# Altium project STM32MEGA.PrjPcb
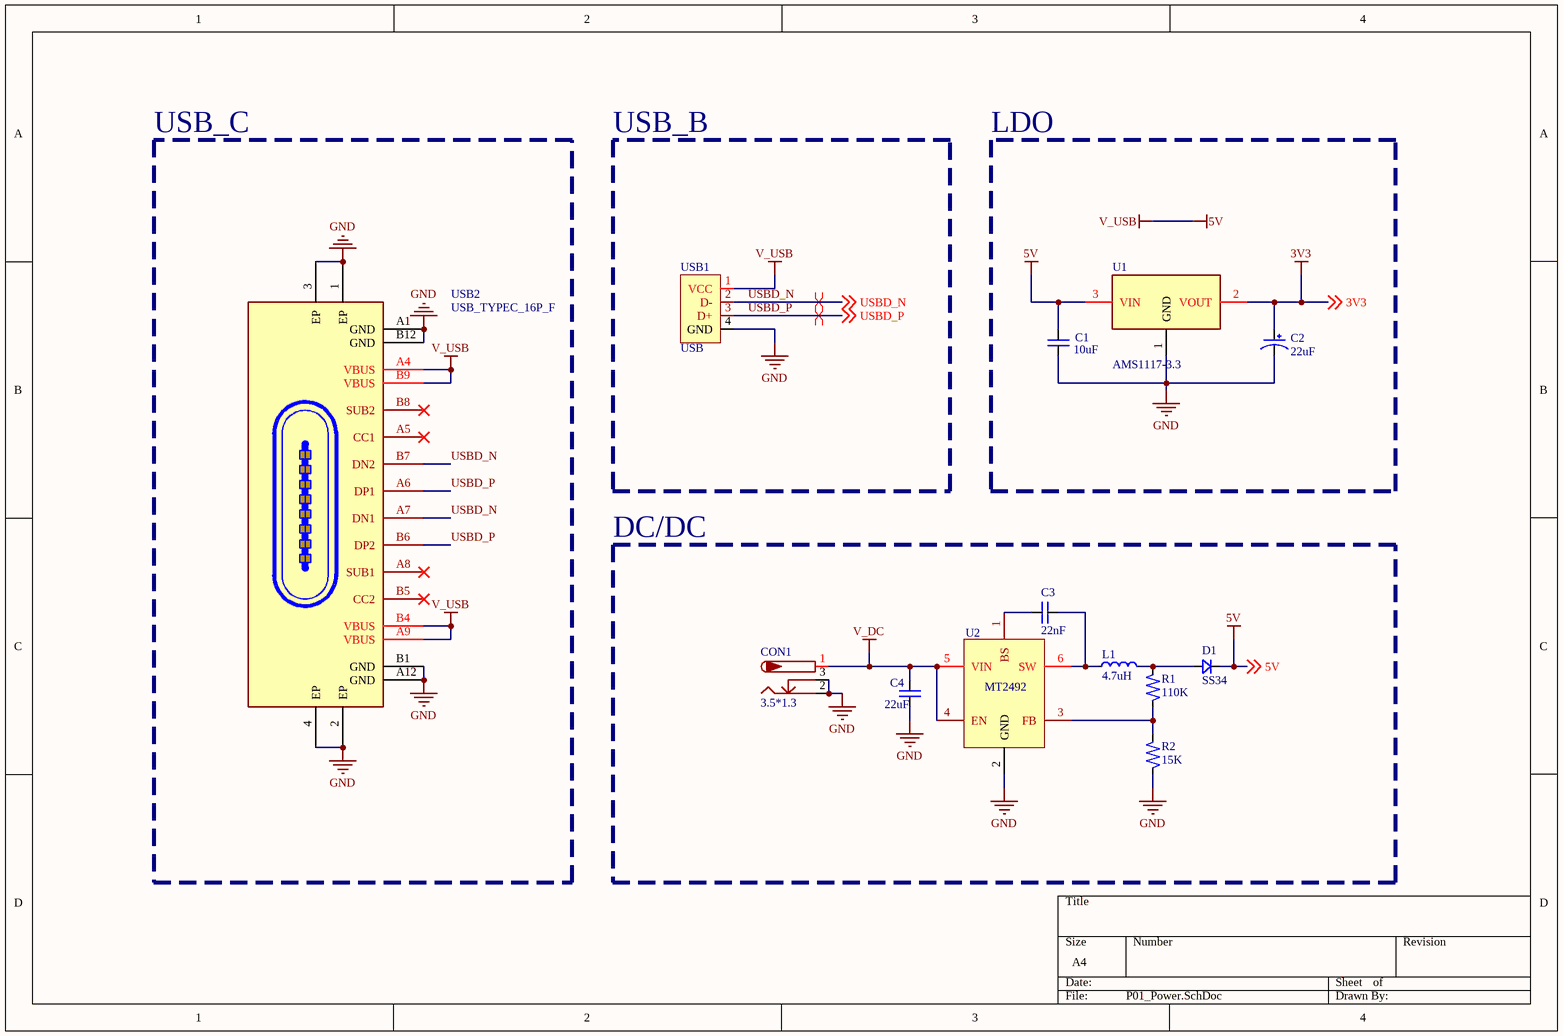
[diagram p0: P01_Power.SchDoc]
3 sheets, 53 parts. Net scope: global (net labels, ports and power ports of the same name join across sheets).
Board file: PCB.PcbDoc
Sheets:
  P01_Power.SchDoc
  P02_MCU.SchDoc
  P03_Connectors.SchDoc

## Sheet P01_Power.SchDoc
size A4; SheetNumber: 1; SheetTotal: 3

### Parts
C1  10uF  [C_0805]
C2  22uF  [CASE-A-3216]
C3  22nF  [C_0603]
C4  22uF  [C_0603]
CON1  3.5*1.3  [DC_Input]
D1  SS34  [SMA]
L1  4.7uH  [L_SMD0420]
R1  110K  [R_0603]
R2  15K  [R_0603]
U1  AMS1117-3.3  [SOT-223]
U2  MT2492  [SOT23-6]
USB1  USB  [USB_TYPEB_4P]
USB2  USB_TYPEC_16P_F  [USB_TYPEC_16P]

### Blocks framed on the sheet
USB_C: USB2
USB_B: USB1
LDO: C1 C2 U1
DC/DC: C3 C4 CON1 D1 L1 R1 R2 U2

### Nets
3V3: C2.1 U1.2(VOUT) ; off-sheet 3V3
5V: C1.1 D1.1 U1.3(VIN) USB1.1(VCC) USB2.A4(VBUS) USB2.A9(VBUS) USB2.B4(VBUS) USB2.B9(VBUS) ; off-sheet 5V  [also labelled V_USB]
GND: C1.2 C2.2 C4.2 CON1.2 CON1.3 R2.1 U1.1(GND) U2.2(GND) USB1.4(GND) USB2.1(EP) USB2.2(EP) USB2.3(EP) USB2.4(EP) USB2.A1(GND) USB2.A12(GND) USB2.B1(GND) USB2.B12(GND)
V_DC: C4.1 CON1.1 U2.4(EN) U2.5(VIN)
USBD_N: USB1.2(D-) USB2.A7(DN1) USB2.B7(DN2) ; off-sheet USBD_N
USBD_P: USB1.3(D+) USB2.A6(DP1) USB2.B6(DP2) ; off-sheet USBD_P
NetC3_1: C3.1 U2.1(BS)
NetC3_2: C3.2 L1.2 U2.6(SW)
NetD1_2: D1.2 L1.1 R1.2
NetR1_1: R1.1 R2.2 U2.3(FB)

Not connected (* = marked no-connect by the designer): USB2 A5(CC1)* A8(SUB1)* B5(CC2)* B8(SUB2)*

### Layout directives
differential pair: USBD_N, USBD_P

### Library data of the parts
C1 C3 C4 = C: 无极性电容
C2 = C_Tan: Tantalum Capacitor / 钽电容
CON1 = DC_Input: 低压电源接口
D1 = D: Diode
L1 = L: Inductor
R1 R2 = R: Resistor
U1 = AMS1117-3.3: LDO to 3V3
U2 = MT2492: BUCK / https://atta.szlcsc.com/upload/public/pdf/source/20221209/5C81DA9662873D3A116170FFBF63E49D.pdf
USB1 = USB_4Pin
USB2 = USB_TYPEC_16P_F: USB母座，TYPEC，16pin

## Sheet P02_MCU.SchDoc
size A4; SheetNumber: 2; SheetTotal: 3
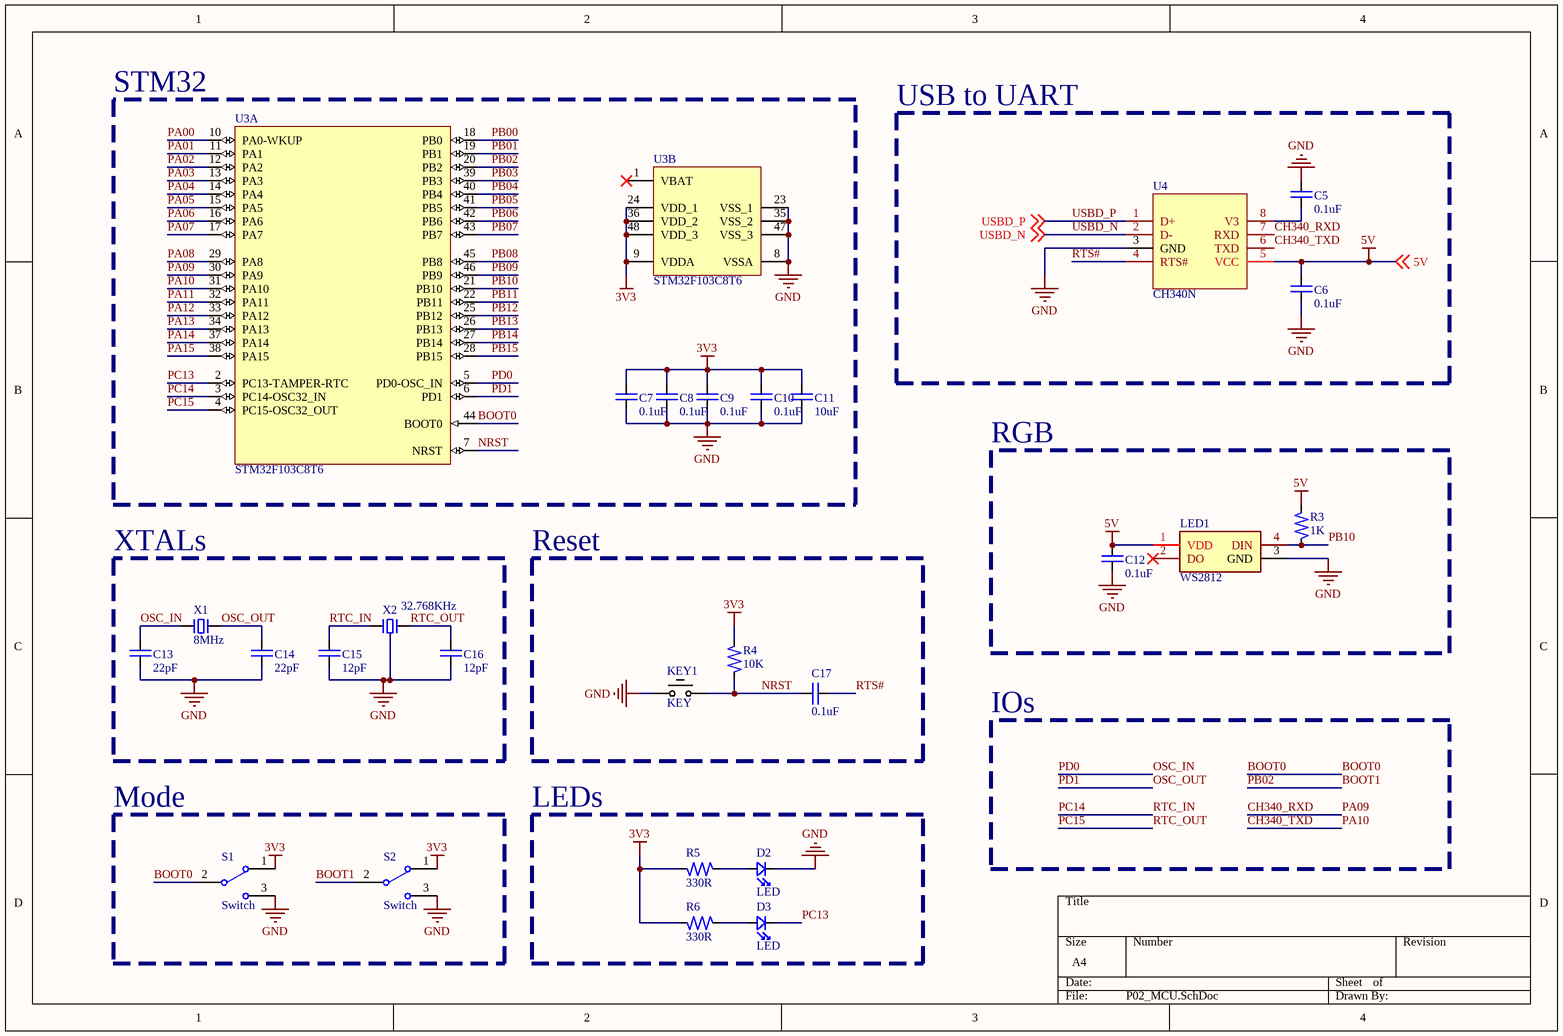
[diagram p1: P02_MCU.SchDoc]

### Parts
C5  0.1uF  [C_0603]
C6  0.1uF  [C_0603]
C7  0.1uF  [C_0603]
C8  0.1uF  [C_0603]
C9  0.1uF  [C_0603]
C10  0.1uF  [C_0603]
C11  10uF  [C_0603]
C12  0.1uF  [C_0603]
C13  22pF  [C_0603]
C14  22pF  [C_0603]
C15  12pF  [C_0603]
C16  12pF  [C_0603]
C17  0.1uF  [C_0603]
D2  LED  [LED_0603]
D3  LED  [LED_0603]
KEY1  KEY  [KEY]
LED1  WS2812  [SMD5050]
R3  1K  [R_0603]
R4  10K  [R_0603]
R5  330R  [R_0603]
R6  330R  [R_0603]
S1  Switch  [Sliding Switch_3P]
S2  Switch  [Sliding Switch_3P]
U3  STM32F103C8T6  [QFP-48]  (parts A,B of 2)
U4  CH340N  [SOP-8]
X1  8MHz  [XTAL_HC49S]
X2  32.768KHz  [XTAL_DT26]

### Blocks framed on the sheet
STM32: C7-C11 U3
USB to UART: C5 C6 U4
RGB: C12 LED1 R3
XTALs: C13-C16 X1 X2
Reset: C17 KEY1 R4
Mode: S1 S2
LEDs: D2 D3 R5 R6

### Nets
3V3: C7.1 C8.2 C9.2 C10.2 C11.2 R4.1 R5.1 R6.1 S1.1 S2.1 U3.9(VDDA) U3.24(VDD_1) U3.36(VDD_2) U3.48(VDD_3)
5V: C6.1 C12.1 LED1.1(VDD) R3.2 U4.5(VCC) ; off-sheet 5V
GND: C5.1 C6.2 C7.2 C8.1 C9.1 C10.1 C11.1 C12.2 C13.2 C14.2 C15.2 C16.2 D2.1 KEY1.2 LED1.3(GND) S1.3 S2.3 U3.8(VSSA) U3.23(VSS_1) U3.35(VSS_2) U3.47(VSS_3) U4.3(GND) X2.0
BOOT0: S1.2 U3.44(BOOT0)
BOOT1: S2.2 U3.20(PB2)  [also labelled PB02]
CH340_RXD: U3.30(PA9) U4.7(RXD)  [also labelled PA09]
CH340_TXD: U3.31(PA10) U4.6(TXD)  [also labelled PA10]
NRST: C17.1 KEY1.1 R4.2 U3.7(NRST)
OSC_IN: C13.1 U3.5(PD0-OSC_IN) X1.1  [also labelled PD0]
OSC_OUT: C14.1 U3.6(PD1) X1.2  [also labelled PD1]
PA00: U3.10(PA0-WKUP)
PA01: U3.11(PA1)
PA02: U3.12(PA2)
PA03: U3.13(PA3)
PA04: U3.14(PA4)
PA05: U3.15(PA5)
PA06: U3.16(PA6)
PA07: U3.17(PA7)
PA08: U3.29(PA8)
PA11: U3.32(PA11)
PA12: U3.33(PA12)
PA13: U3.34(PA13)  [project net JTMS_SWDIO]
PA14: U3.37(PA14)  [project net JTCK_SWCLK]
PA15: U3.38(PA15)  [project net JTDI]
PB00: U3.18(PB0)
PB01: U3.19(PB1)
PB03: U3.39(PB3)  [project net JTDO]
PB04: U3.40(PB4)  [project net NJTRST]
PB05: U3.41(PB5)
PB06: U3.42(PB6)
PB07: U3.43(PB7)
PB08: U3.45(PB8)
PB09: U3.46(PB9)
PB10: LED1.4(DIN) R3.1 U3.21(PB10)
PB11: U3.22(PB11)
PB12: U3.25(PB12)
PB13: U3.26(PB13)
PB14: U3.27(PB14)
PB15: U3.28(PB15)
PC13: D3.1 U3.2(PC13-TAMPER-RTC)
PC14: C15.1 U3.3(PC14-OSC32_IN) X2.1  [also labelled RTC_IN]
PC15: C16.1 U3.4(PC15-OSC32_OUT) X2.2  [also labelled RTC_OUT]
RTS#: C17.2 U4.4(RTS#)
USBD_N: U4.2(D-) ; off-sheet USBD_N
USBD_P: U4.1(D+) ; off-sheet USBD_P
NetC5_2: C5.2 U4.8(V3)
NetD2_2: D2.2 R5.2
NetD3_2: D3.2 R6.2

Not connected (* = marked no-connect by the designer): LED1 2(DO)*; U3 1(VBAT)*

### Notes on the sheet
- IOs

### Library data of the parts
C5-C17 = C: 无极性电容
D2 D3 = LED: Diode
KEY1 = KEY: 通用2脚按键
R3-R6 = R: Resistor
U3 = STM32F103C8T6: STM32 ARM-based 32-bit MCU Performance Line with 64 kB Flash, 20 kB Internal RAM, -40 to +85 Temperature, 48-Pin LQFP, Tray; ComponentLink1Description: Manufacturer URL; ComponentLink1URL: http://www.st.com/; ComponentLink2Description: STM32F103 Datasheet; ComponentLink2URL: http://www.st.com/internet/com/TECHNICAL_RESOURCES/TECHNICAL_LITERATURE/DATASHEET/CD00161566.pdf; ComponentLink3Description: STM32 Family Web Page; ComponentLink3URL: www.st.com/stm32; PackageReference: LQFP48; PackageDescription: 48-Pin Low-Profile Quad Flat Pack, 7 x 7 mm Body, 0.5 mm Pitch (LQFP48)
U4 = CH340N: USB转UART
X1 = XTAL: 晶振
X2 = XTAL_RTC: 晶振

## Sheet P03_Connectors.SchDoc
size A4; SheetNumber: 3; SheetTotal: 3
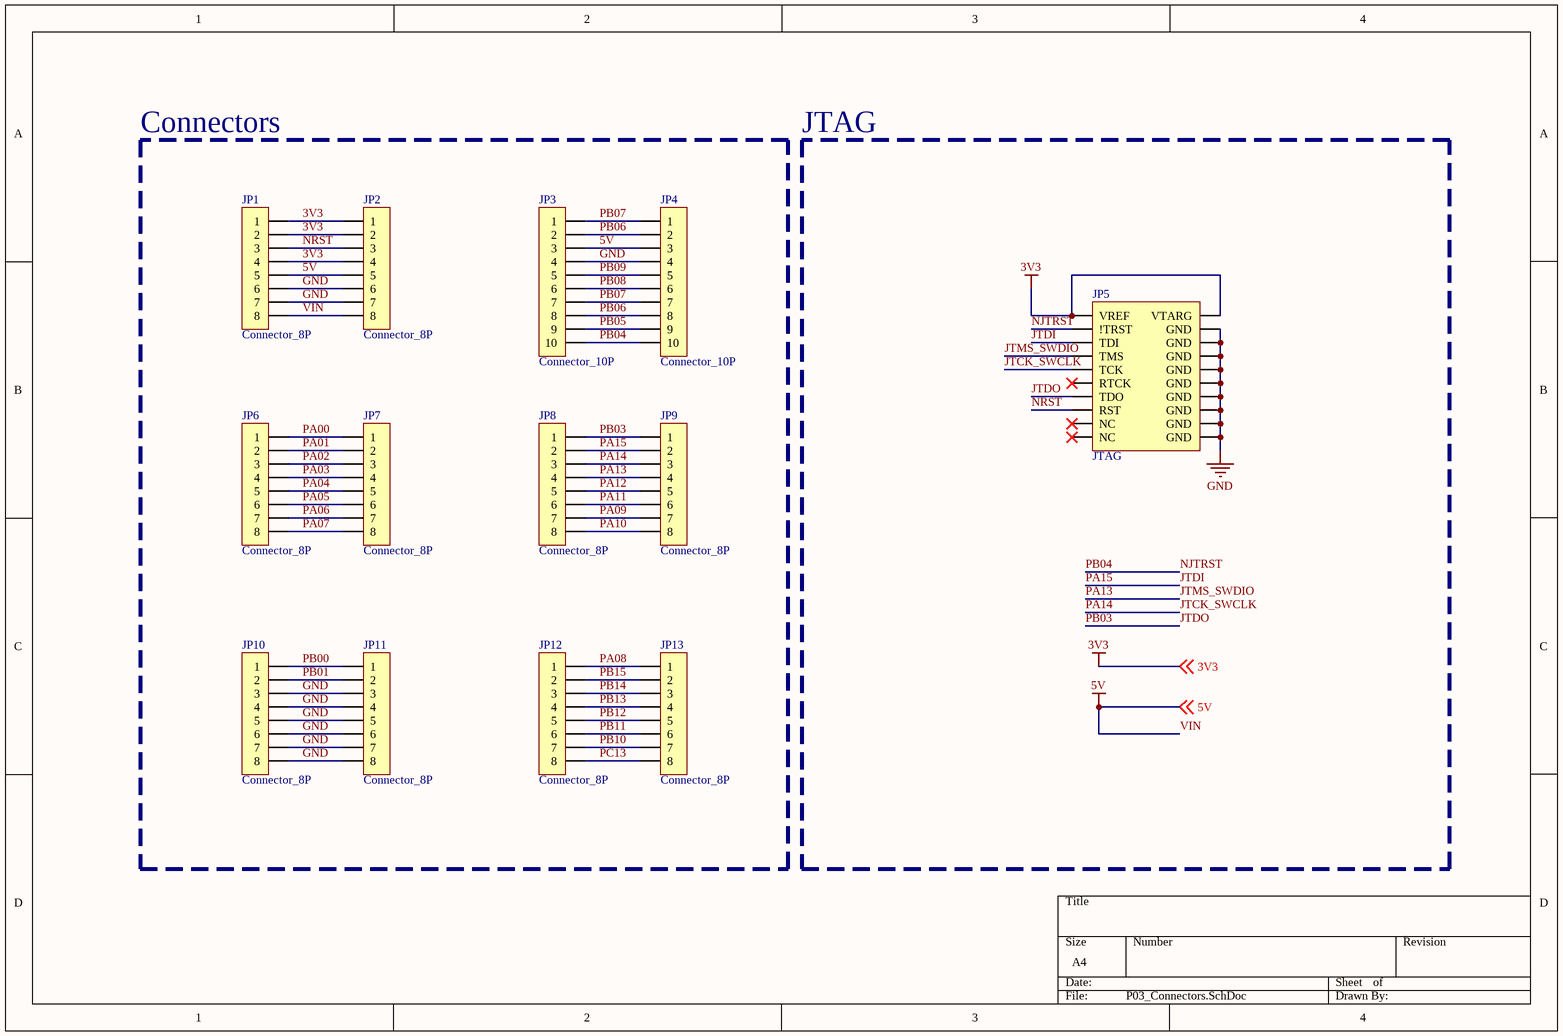
[diagram p2: P03_Connectors.SchDoc]

### Parts
JP1  Connector_8P  [排母_2.54mm_8P]
JP2  Connector_8P  [排针_2.54mm_8P]
JP3  Connector_10P  [排母_2.54mm_10P]
JP4  Connector_10P  [排针_2.54mm_10P]
JP5  JTAG  [JTAG]
JP6  Connector_8P  [排母_2.54mm_8P]
JP7  Connector_8P  [排针_2.54mm_8P]
JP8  Connector_8P  [排母_2.54mm_8P]
JP9  Connector_8P  [排针_2.54mm_8P]
JP10  Connector_8P  [排母_2.54mm_8P]
JP11  Connector_8P  [排针_2.54mm_8P]
JP12  Connector_8P  [排母_2.54mm_8P]
JP13  Connector_8P  [排针_2.54mm_8P]

### Blocks framed on the sheet
Connectors: JP1-JP4 JP6-JP13
JTAG: JP5

### Nets
3V3: JP1.1 JP1.2 JP1.4 JP2.1 JP2.2 JP2.4 JP5.1(VREF) JP5.2(VTARG) ; off-sheet 3V3
5V: JP1.5 JP1.8 JP2.5 JP2.8 JP3.3 JP4.3 ; off-sheet 5V  [also labelled VIN]
GND: JP1.6 JP1.7 JP2.6 JP2.7 JP3.4 JP4.4 JP5.4(GND) JP5.6(GND) JP5.8(GND) JP5.10(GND) JP5.12(GND) JP5.14(GND) JP5.16(GND) JP5.18(GND) JP5.20(GND) JP10.3 JP10.4 JP10.5 JP10.6 JP10.7 JP10.8 JP11.3 JP11.4 JP11.5 JP11.6 JP11.7 JP11.8
JTCK_SWCLK: JP5.9(TCK) JP8.3 JP9.3  [also labelled PA14]
JTDI: JP5.5(TDI) JP8.2 JP9.2  [also labelled PA15]
JTDO: JP5.13(TDO) JP8.1 JP9.1  [also labelled PB03]
JTMS_SWDIO: JP5.7(TMS) JP8.4 JP9.4  [also labelled PA13]
NJTRST: JP3.10 JP4.10 JP5.3(!TRST)  [also labelled PB04]
NRST: JP1.3 JP2.3 JP5.15(RST)
PA00: JP6.1 JP7.1
PA01: JP6.2 JP7.2
PA02: JP6.3 JP7.3
PA03: JP6.4 JP7.4
PA04: JP6.5 JP7.5
PA05: JP6.6 JP7.6
PA06: JP6.7 JP7.7
PA07: JP6.8 JP7.8
PA08: JP12.1 JP13.1
PA09: JP8.7 JP9.7  [project net CH340_RXD]
PA10: JP8.8 JP9.8  [project net CH340_TXD]
PA11: JP8.6 JP9.6
PA12: JP8.5 JP9.5
PB00: JP10.1 JP11.1
PB01: JP10.2 JP11.2
PB05: JP3.9 JP4.9
PB06: JP3.2 JP3.8 JP4.2 JP4.8
PB07: JP3.1 JP3.7 JP4.1 JP4.7
PB08: JP3.6 JP4.6
PB09: JP3.5 JP4.5
PB10: JP12.7 JP13.7
PB11: JP12.6 JP13.6
PB12: JP12.5 JP13.5
PB13: JP12.4 JP13.4
PB14: JP12.3 JP13.3
PB15: JP12.2 JP13.2
PC13: JP12.8 JP13.8

Not connected (* = marked no-connect by the designer): JP5 11(RTCK)* 17(NC)* 19(NC)*

## Nets that join several sheets
3V3: P01_Power (C2.1 U1.2), P02_MCU (14 pins), P03_Connectors (8 pins)
5V: P01_Power (8 pins), P02_MCU (5 pins), P03_Connectors (6 pins)
GND: P01_Power (17 pins), P02_MCU (23 pins), P03_Connectors (27 pins)
CH340_RXD: P02_MCU (U3.30 U4.7), P03_Connectors (JP8.7 JP9.7)
CH340_TXD: P02_MCU (U3.31 U4.6), P03_Connectors (JP8.8 JP9.8)
JTCK_SWCLK: P02_MCU (U3.37), P03_Connectors (JP5.9 JP8.3 JP9.3)
JTDI: P02_MCU (U3.38), P03_Connectors (JP5.5 JP8.2 JP9.2)
JTDO: P02_MCU (U3.39), P03_Connectors (JP5.13 JP8.1 JP9.1)
JTMS_SWDIO: P02_MCU (U3.34), P03_Connectors (JP5.7 JP8.4 JP9.4)
NJTRST: P02_MCU (U3.40), P03_Connectors (JP3.10 JP4.10 JP5.3)
NRST: P02_MCU (C17.1 KEY1.1 R4.2 U3.7), P03_Connectors (JP1.3 JP2.3 JP5.15)
PA00: P02_MCU (U3.10), P03_Connectors (JP6.1 JP7.1)
PA01: P02_MCU (U3.11), P03_Connectors (JP6.2 JP7.2)
PA02: P02_MCU (U3.12), P03_Connectors (JP6.3 JP7.3)
PA03: P02_MCU (U3.13), P03_Connectors (JP6.4 JP7.4)
PA04: P02_MCU (U3.14), P03_Connectors (JP6.5 JP7.5)
PA05: P02_MCU (U3.15), P03_Connectors (JP6.6 JP7.6)
PA06: P02_MCU (U3.16), P03_Connectors (JP6.7 JP7.7)
PA07: P02_MCU (U3.17), P03_Connectors (JP6.8 JP7.8)
PA08: P02_MCU (U3.29), P03_Connectors (JP12.1 JP13.1)
PA11: P02_MCU (U3.32), P03_Connectors (JP8.6 JP9.6)
PA12: P02_MCU (U3.33), P03_Connectors (JP8.5 JP9.5)
PB00: P02_MCU (U3.18), P03_Connectors (JP10.1 JP11.1)
PB01: P02_MCU (U3.19), P03_Connectors (JP10.2 JP11.2)
PB05: P02_MCU (U3.41), P03_Connectors (JP3.9 JP4.9)
PB06: P02_MCU (U3.42), P03_Connectors (JP3.2 JP3.8 JP4.2 JP4.8)
PB07: P02_MCU (U3.43), P03_Connectors (JP3.1 JP3.7 JP4.1 JP4.7)
PB08: P02_MCU (U3.45), P03_Connectors (JP3.6 JP4.6)
PB09: P02_MCU (U3.46), P03_Connectors (JP3.5 JP4.5)
PB10: P02_MCU (LED1.4 R3.1 U3.21), P03_Connectors (JP12.7 JP13.7)
PB11: P02_MCU (U3.22), P03_Connectors (JP12.6 JP13.6)
PB12: P02_MCU (U3.25), P03_Connectors (JP12.5 JP13.5)
PB13: P02_MCU (U3.26), P03_Connectors (JP12.4 JP13.4)
PB14: P02_MCU (U3.27), P03_Connectors (JP12.3 JP13.3)
PB15: P02_MCU (U3.28), P03_Connectors (JP12.2 JP13.2)
PC13: P02_MCU (D3.1 U3.2), P03_Connectors (JP12.8 JP13.8)
USBD_N: P01_Power (USB1.2 USB2.A7 USB2.B7), P02_MCU (U4.2)
USBD_P: P01_Power (USB1.3 USB2.A6 USB2.B6), P02_MCU (U4.1)